# EAGLE design TIVA_SHIELD_Ver_2.0 (EAGLE 9.6.2)
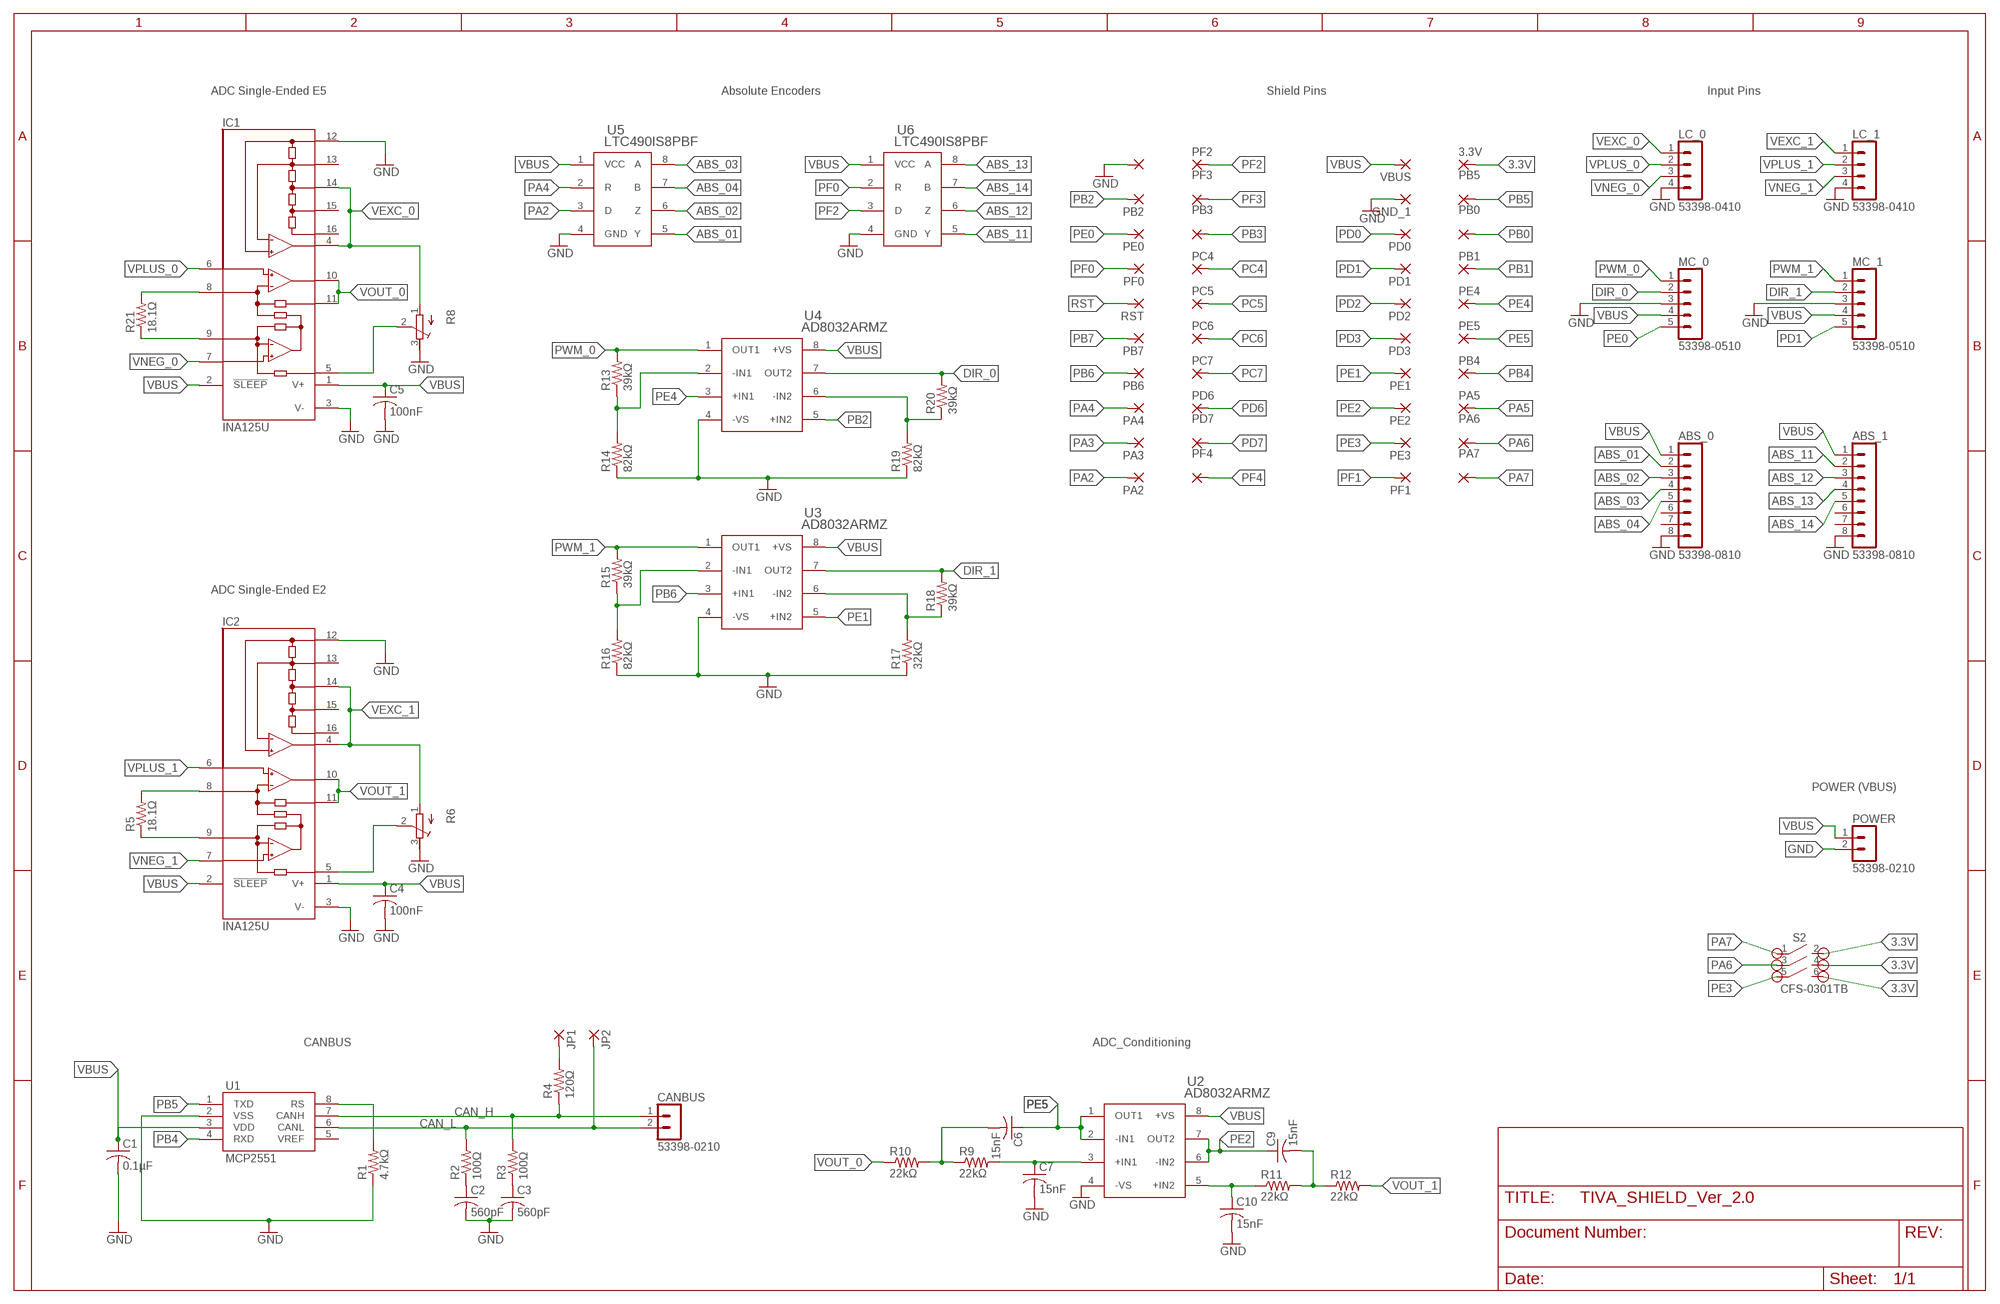
[diagram p0: schematic, sheet 1]

## Parts
3.3V  1,6/0,9  [1,6/0,9]
ABS_0  53398-0810  [53398-0810]
ABS_1  53398-0810  [53398-0810]
C1  0.1µF  C-USC0805  [C0805]
C2  560pF  C-USC0805  [C0805]
C3  560pF  C-USC0805  [C0805]
C4  100nF  C-USC0805  [C0805]
C5  100nF  C-USC0805  [C0805]
C6  15nF  C-USC0805  [C0805]
C7  15nF  C-USC0805  [C0805]
C9  15nF  C-USC0805  [C0805]
C10  15nF  C-USC0805  [C0805]
CANBUS  53398-0210  [53398-0210]
GND_0  1,6/0,9  [1,6/0,9]
GND_1  1,6/0,9  [1,6/0,9]
IC1  INA125U  [SO16-1]
IC2  INA125U  [SO16-1]
JP1  1,6/0,9  [1,6/0,9]
JP2  1,6/0,9  [1,6/0,9]
LC_0  53398-0410  [53398-0410]
LC_1  53398-0410  [53398-0410]
MC_0  53398-0510  [53398-0510]
MC_1  53398-0510  [53398-0510]
PA2  1,6/0,9  [1,6/0,9]
PA3  1,6/0,9  [1,6/0,9]
PA4  1,6/0,9  [1,6/0,9]
PA5  1,6/0,9  [1,6/0,9]
PA6  1,6/0,9  [1,6/0,9]
PA7  1,6/0,9  [1,6/0,9]
PB0  1,6/0,9  [1,6/0,9]
PB1  1,6/0,9  [1,6/0,9]
PB2  1,6/0,9  [1,6/0,9]
PB3  1,6/0,9  [1,6/0,9]
PB4  1,6/0,9  [1,6/0,9]
PB5  1,6/0,9  [1,6/0,9]
PB6  1,6/0,9  [1,6/0,9]
PB7  1,6/0,9  [1,6/0,9]
PC4  1,6/0,9  [1,6/0,9]
PC5  1,6/0,9  [1,6/0,9]
PC6  1,6/0,9  [1,6/0,9]
PC7  1,6/0,9  [1,6/0,9]
PD0  1,6/0,9  [1,6/0,9]
PD1  1,6/0,9  [1,6/0,9]
PD2  1,6/0,9  [1,6/0,9]
PD3  1,6/0,9  [1,6/0,9]
PD6  1,6/0,9  [1,6/0,9]
PD7  1,6/0,9  [1,6/0,9]
PE0  1,6/0,9  [1,6/0,9]
PE1  1,6/0,9  [1,6/0,9]
PE2  1,6/0,9  [1,6/0,9]
PE3  1,6/0,9  [1,6/0,9]
PE4  1,6/0,9  [1,6/0,9]
PE5  1,6/0,9  [1,6/0,9]
PF0  1,6/0,9  [1,6/0,9]
PF1  1,6/0,9  [1,6/0,9]
PF2  1,6/0,9  [1,6/0,9]
PF3  1,6/0,9  [1,6/0,9]
PF4  1,6/0,9  [1,6/0,9]
POWER  53398-0210  [53398-0210]
R1  4.7kΩ  R-US_R0805  [R0805]
R2  100Ω  R-US_R0805  [R0805]
R3  100Ω  R-US_R0805  [R0805]
R4  120Ω  R-US_R0805  [R0805]
R5  18.1Ω  R-US_R0805  [R0805]
R6  R-TRIMM64W  [RTRIM64W]
R8  R-TRIMM64W  [RTRIM64W]
R9  22kΩ  R-US_R0805  [R0805]
R10  22kΩ  R-US_R0805  [R0805]
R11  22kΩ  R-US_R0805  [R0805]
R12  22kΩ  R-US_R0805  [R0805]
R13  39kΩ  R-US_R0805  [R0805]
R14  82kΩ  R-US_R0805  [R0805]
R15  39kΩ  R-US_R0805  [R0805]
R16  82kΩ  R-US_R0805  [R0805]
R17  32kΩ  R-US_R0805  [R0805]
R18  39kΩ  R-US_R0805  [R0805]
R19  82kΩ  R-US_R0805  [R0805]
R20  39kΩ  R-US_R0805  [R0805]
R21  18.1Ω  R-US_R0805  [R0805]
RST  1,6/0,9  [1,6/0,9]
S2  CFS-0301TB  CFS-0301TBSMD  [CFS-0301TB]
U1  MCP2551  [SO08]
U2  AD8032ARMZ  [RM_8]
U3  AD8032ARMZ  [RM_8]
U4  AD8032ARMZ  [RM_8]
U5  LTC490IS8PBF  [SO-8_S]
U6  LTC490IS8PBF  [SO-8_S]
VBUS  1,6/0,9  [1,6/0,9]

## Nets
3.3V: 3.3V.1(P) S2.2 S2.4 S2.6
ABS_01: ABS_0.2 U5.5(Y)
ABS_02: ABS_0.3 U5.6(Z)
ABS_03: ABS_0.4 U5.8(A)
ABS_04: ABS_0.5 U5.7(B)
ABS_11: ABS_1.2 U6.5(Y)
ABS_12: ABS_1.3 U6.6(Z)
ABS_13: ABS_1.4 U6.8(A)
ABS_14: ABS_1.5 U6.7(B)
CAN_H: CANBUS.1 R3.2 R4.1 U1.7(CANH)
CAN_L: CANBUS.2 JP2.1(P) R2.2 U1.6(CANL)
DIR_0: MC_0.2 R20.2 U4.7(OUT2)
DIR_1: MC_1.2 R18.2 U3.7(OUT2)
GND: ABS_0.8 ABS_1.8 C1.2 C2.2 C3.2 C4.2 C5.2 C7.2 C10.2 GND_0.1(P) GND_1.1(P) IC1.3(V-) IC1.12(REFCOM) IC2.3(V-) IC2.12(REFCOM) LC_0.4 LC_1.4 MC_0.3 MC_1.3 POWER.2 R1.1 R6.3(E) R8.3(E) R14.1 R16.1 R17.1 R19.1 U1.2(VSS) U2.4(-VS) U3.4(-VS) U4.4(-VS) U5.4(GND) U6.4(GND)
N$1: R1.2 U1.8(RS)
N$4: C2.1 R2.1
N$5: C3.1 R3.1
N$6: JP1.1(P) R4.2
N$7: IC2.9(RG) R5.1
N$8: IC2.8(RG) R5.2
N$9: IC2.5(REF) R6.2(S)
N$10: IC1.9(RG) R21.1
N$11: IC1.8(RG) R21.2
N$12: IC1.5(REF) R8.2(S)
N$13: C10.1 R11.1 U2.5(+IN2)
N$14: C9.2 R11.2 R12.1
N$15: C7.1 R9.2 U2.3(+IN1)
N$16: R19.2 R20.1 U4.6(-IN2)
N$17: R17.2 R18.1 U3.6(-IN2)
N$18: C6.2 R9.1 R10.2
N$19: R13.1 R14.2 U4.2(-IN1)
N$20: R15.1 R16.2 U3.2(-IN1)
PA2: PA2.1(P) U5.3(D)
PA3: PA3.1(P)
PA4: PA4.1(P) U5.2(R)
PA5: PA5.1(P)
PA6: PA6.1(P) S2.3
PA7: PA7.1(P) S2.1
PB0: PB0.1(P)
PB1: PB1.1(P)
PB2: PB2.1(P) U4.5(+IN2)
PB3: PB3.1(P)
PB4: PB4.1(P) U1.4(RXD)
PB5: PB5.1(P) U1.1(TXD)
PB6: PB6.1(P) U3.3(+IN1)
PB7: PB7.1(P)
PC4: PC4.1(P)
PC5: PC5.1(P)
PC6: PC6.1(P)
PC7: PC7.1(P)
PD0: PD0.1(P)
PD1: MC_1.5 PD1.1(P)
PD2: PD2.1(P)
PD3: PD3.1(P)
PD6: PD6.1(P)
PD7: PD7.1(P)
PE0: MC_0.5 PE0.1(P)
PE1: PE1.1(P) U3.5(+IN2)
PE2: C9.1 PE2.1(P) U2.6(-IN2) U2.7(OUT2)
PE3: PE3.1(P) S2.5
PE4: PE4.1(P) U4.3(+IN1)
PE5: C6.1 PE5.1(P) U2.1(OUT1) U2.2(-IN1)
PF0: PF0.1(P) U6.2(R)
PF1: PF1.1(P)
PF2: PF2.1(P) U6.3(D)
PF3: PF3.1(P)
PF4: PF4.1(P)
PWM_0: MC_0.1 R13.2 U4.1(OUT1)
PWM_1: MC_1.1 R15.2 U3.1(OUT1)
RST: RST.1(P)
VBUS: ABS_0.1 ABS_1.1 C1.1 C4.1 C5.1 IC1.1(V+) IC1.2(!SLEEP) IC2.1(V+) IC2.2(!SLEEP) MC_0.4 MC_1.4 POWER.1 U1.3(VDD) U2.8(+VS) U3.8(+VS) U4.8(+VS) U5.1(VCC) U6.1(VCC) VBUS.1(P)
VEXC_0: IC1.4(REFOUT) IC1.14(REF2.5) LC_0.1 R8.1(A)
VEXC_1: IC2.4(REFOUT) IC2.14(REF2.5) LC_1.1 R6.1(A)
VNEG_0: IC1.7(-IN) LC_0.3
VNEG_1: IC2.7(-IN) LC_1.3
VOUT_0: IC1.10(OUT) IC1.11(SENSE) R10.1
VOUT_1: IC2.10(OUT) IC2.11(SENSE) R12.2
VPLUS_0: IC1.6(+IN) LC_0.2
VPLUS_1: IC2.6(+IN) LC_1.2
Unconnected: ABS_0.6 ABS_0.7 ABS_1.6 ABS_1.7 IC1.13(REFBG) IC1.15(REF5) IC1.16(REF10) IC2.13(REFBG) IC2.15(REF5) IC2.16(REF10) U1.5(VREF)

## Notes on the sheet
- ADC Single-Ended E5 | Absolute Encoders | Shield Pins | Input Pins
- ADC Single-Ended E2
- POWER (VBUS)
- CANBUS | ADC_Conditioning

## Library data of the parts
3.3V GND_0 GND_1 JP1 JP2 PA2-PA7 PB0 PB1-PB7 PC4-PC7 PD0 PD1-PD3 PD6 PD7 PE0 PE1-PE5 PF0 PF1-PF4 RST VBUS = wirepad:1,6/0,9: THROUGH-HOLE PAD
ABS_0 ABS_1 = con-molex-picoblade:53398-0810: HEADER
C1-C7 C9 C10 = rcl:C-US: CAPACITOR, American symbol; SPICEPREFIX: C
CANBUS POWER = con-molex-picoblade:53398-0210: HEADER
IC1 IC2 = burr-brown_1:INA125: Instrumentation Amplifier with Precision Voltage Reference; MF: TEXAS INSTRUMENT CONNECTORS; MPN: INA125U; OC_FARNELL: 1304375; OC_NEWARK: 80K5901
LC_0 LC_1 = con-molex-picoblade:53398-0410: HEADER
MC_0 MC_1 = con-molex-picoblade:53398-0510: HEADER
R1-R5 R9-R21 = rcl:R-US_: RESISTOR, American symbol; SPICEPREFIX: R
R6 R8 = rcl:R-TRIMM: Trimm resistor; SPICEMODEL: X; SPICEPREFIXL: POT
S2 = TREC_Library:CFS-0301TB: CFS Slide Switches 3 Position Slide Switch CFS-0301TB CFS = Series Name 03 = Number of bits 01 = Flat Knob non washable type T = Packing = Taping B = Gull Wing CFS DATASHEET <https://www.nidec-copal-electronics.com/e/catalog/switch/cfs.pdf>
U1 = SparkFun-IC-Comms:MCP2551: MCP2551 High Speed CAN Transceiver High speed CAN transceiver Datasheet <http://www.sparkfun.com/datasheets/DevTools/Arduino/MCP2551.pdf> SparkFun Products CAN-BUS Shield <https://www.sparkfun.com/products/13262> (DEV-13262) SparkFun OBD-II UART <https://www.sparkfun.com/products/9555> (WIG-09555); PROD_ID: IC-09907
U2-U4 = AD8032ARMZ:AD8032ARMZ; MANUFACTURER_PART_NUMBER: AD8032ARMZ; VENDOR: Analog Devices Inc
U5 U6 = LTC490:LTC490IS8PBF; MANUFACTURER_PART_NUMBER: LTC490IS8#PBF; VENDOR: Linear Technology

## Board
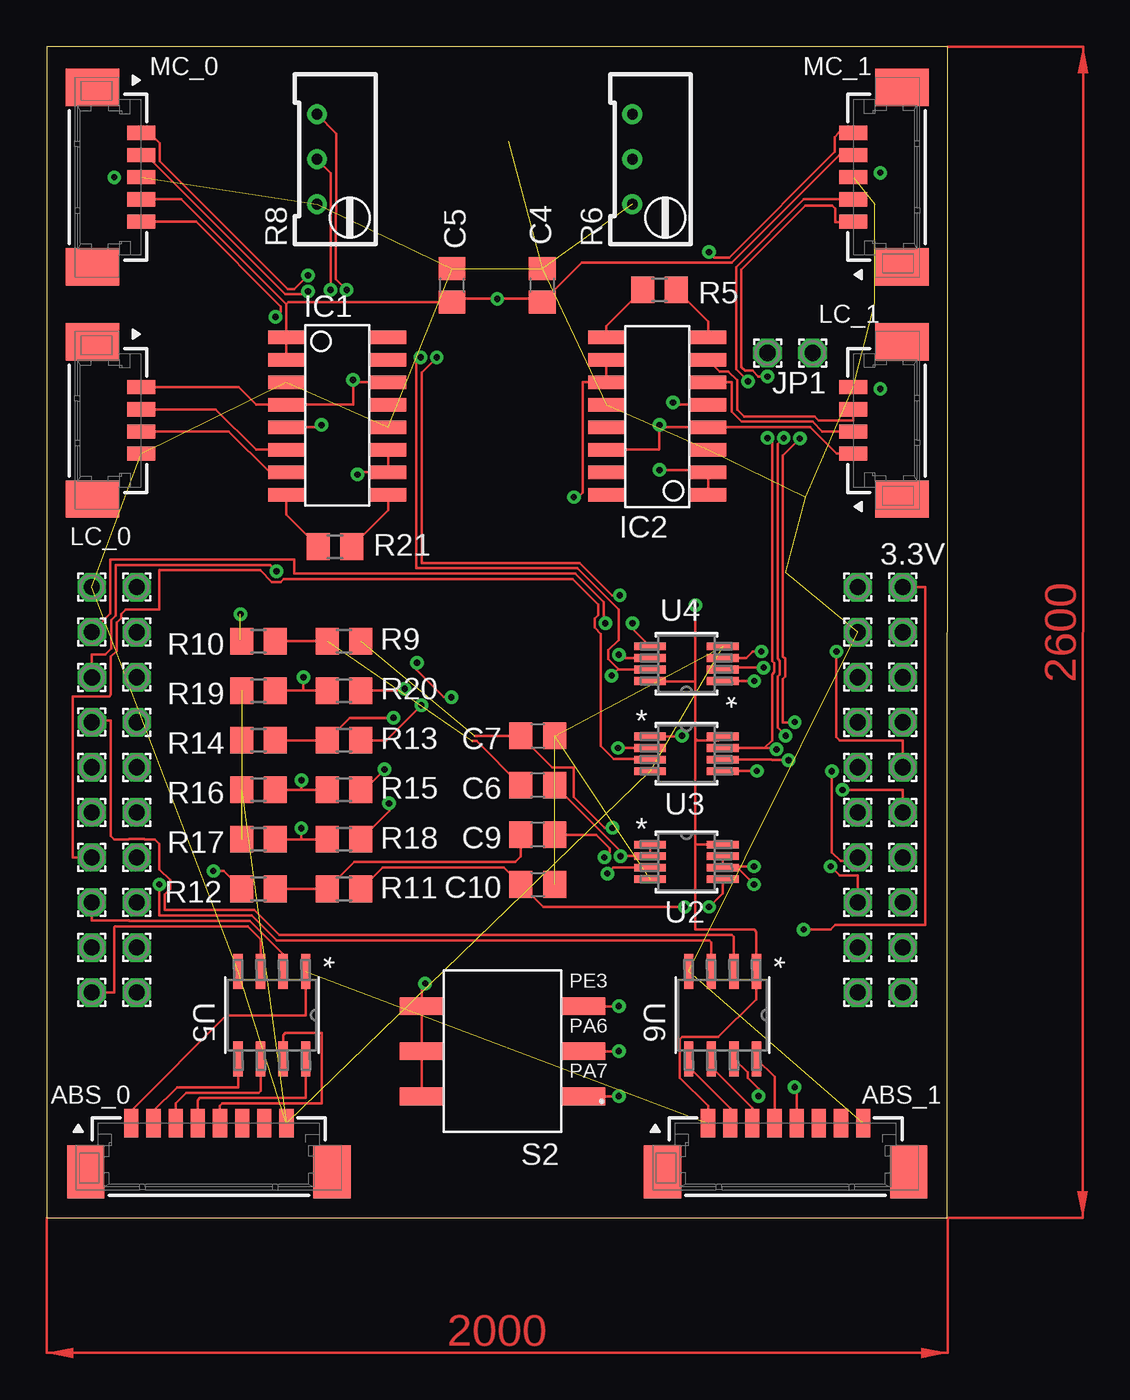
[diagram p1: board, top side]
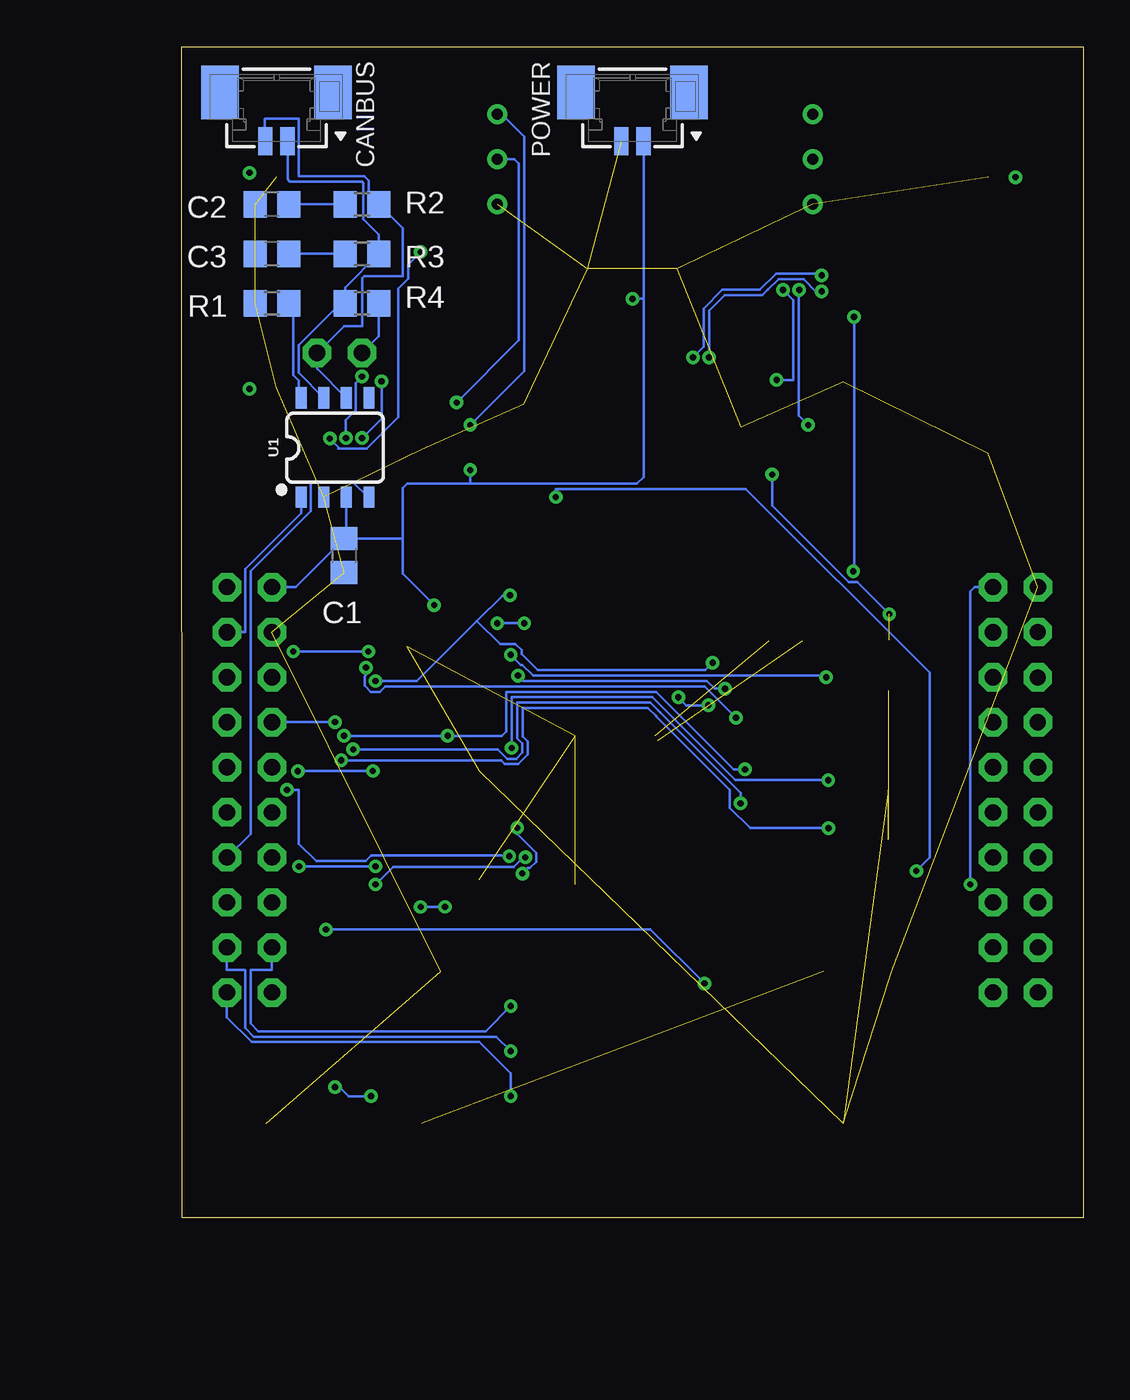
[diagram p2: board, bottom side, seen from below]

Size 50.81 x 66.04 mm. Coordinates in mm from the lower left corner, seen from the top.
Outline: 0,0 50.78,0 50.8,66.04 0,66.04 0,0
Copper layers (1*16): Top 0.035mm / dielectric 1.5mm / Bottom 0.035mm
Design rules "default": minimum track width 6mil, minimum drill 0.35mm, track to track 6mil, track to pad 6mil, pad to pad 6mil, via to via 6mil, smd to smd 6mil, copper to edge 40mil, drill to drill 6mil, minimum pad ring 10mil, minimum via ring 8mil, stop-mask expansion 4mil, vias tented up to drill 0mil, thermal gap 10mil

### Footprints (pad centres in the part's own frame; a part is rotated, then mirrored left to right if it is on the bottom)
1,6/0,9 = drill 0.914 pad 1.6 octagon: 1 0,0
53398-0810 = smd 0.8 x 1.6: 1 4.375,0; 2 3.125,0; 3 1.875,0; 4 0.625,0; 5 -0.625,0; 6 -1.875,0; 7 -3.125,0; 8 -4.375,0 | smd 2.1 x 3: M1 6.935,2.75; M2 -6.935,2.75
C0805 = smd 1.3 x 1.5: 1 -0.95,0; 2 0.95,0
53398-0210 = smd 0.8 x 1.6: 1 0.625,0; 2 -0.625,0 | smd 2.1 x 3: M1 3.185,2.75; M2 -3.185,2.75
SO16-1 = smd 0.762 x 2.032: 1 -4.445,-4.775; 2 -3.175,-4.775; 3 -1.905,-4.775; 4 -0.635,-4.775; 5 0.635,-4.775; 6 1.905,-4.775; 7 3.175,-4.775; 8 4.445,-4.775; 9 4.445,0.965; 10 3.175,0.965; 11 1.905,0.965; 12 0.635,0.965; 13 -0.635,0.965; 14 -1.905,0.965; 15 -3.175,0.965; 16 -4.445,0.965
53398-0410 = smd 0.8 x 1.6: 1 1.875,0; 2 0.625,0; 3 -0.625,0; 4 -1.875,0 | smd 2.1 x 3: M1 4.435,2.75; M2 -4.435,2.75
53398-0510 = smd 0.8 x 1.6: 1 2.5,0; 2 1.25,0; 3 0,0; 4 -1.25,0; 5 -2.5,0 | smd 2.1 x 3: M1 5.06,2.75; M2 -5.06,2.75
R0805 = smd 1.3 x 1.5: 1 -0.95,0; 2 0.95,0
RTRIM64W = drill 0.61: 1 1.27,-2.54; 2 1.27,0; 3 1.27,2.54
CFS-0301TB = smd 1 x 2.5: 1 0.5,1.25; 2 0.5,10.35; 3 3.04,1.25; 4 3.04,10.35; 5 5.58,1.25; 6 5.58,10.35
SO08 = smd 0.6 x 1.2: 1 -1.905,-2.8; 2 -0.635,-2.8; 3 0.635,-2.8; 4 1.905,-2.8; 5 1.905,2.8; 6 0.635,2.8; 7 -0.635,2.8; 8 -1.905,2.8
RM_8 = smd 1.778 x 0.432: 1 -2.045,0.975; 2 -2.045,0.325; 3 -2.045,-0.325; 4 -2.045,-0.975; 5 2.045,-0.975; 6 2.045,-0.325; 7 2.045,0.325; 8 2.045,0.975
SO-8_S = smd 1.981 x 0.533: 1 -2.464,1.905; 2 -2.464,0.635; 3 -2.464,-0.635; 4 -2.464,-1.905; 5 2.464,-1.905; 6 2.464,-0.635; 7 2.464,0.635; 8 2.464,1.905

### Placement (x,y rotation side)
3.3V  48.26,35.56 0 top
ABS_0  9.14,5.33 180 top
ABS_1  41.66,5.33 180 top
C1  41.66,37.34 270 bottom
C2  45.72,57.15 180 bottom
C3  45.72,54.36 180 bottom
C4  27.94,52.58 90 top
C5  22.86,52.58 90 top
C6  27.69,24.38 180 top
C7  27.69,27.18 0 top
C9  27.69,21.59 180 top
C10  27.69,18.8 0 top
CANBUS  45.47,60.71 0 bottom
GND_0  2.54,35.56 0 top
GND_1  45.72,33.02 0 top
IC1  18.29,45.21 270 top
IC2  32.51,45.21 90 top
JP1  40.64,48.77 90 top
JP2  43.18,48.77 90 top
LC_0  5.33,44.96 90 top
LC_1  45.47,44.96 270 top
MC_0  5.33,58.67 90 top
MC_1  45.47,58.67 270 top
PA2  2.54,12.7 0 top
PA3  2.54,15.24 0 top
PA4  2.54,17.78 0 top
PA5  48.26,17.78 0 top
PA6  48.26,15.24 0 top
PA7  48.26,12.7 0 top
PB0  48.26,30.48 0 top
PB1  48.26,27.94 0 top
PB2  2.55,33.03 0 top
PB3  5.08,30.48 0 top
PB4  48.26,20.32 0 top
PB5  48.26,33.02 0 top
PB6  2.54,20.32 0 top
PB7  2.54,22.86 0 top
PC4  5.08,27.94 0 top
PC5  5.08,25.4 0 top
PC6  5.08,22.86 0 top
PC7  5.08,20.32 0 top
PD0  45.72,30.48 0 top
PD1  45.72,27.94 0 top
PD2  45.72,25.4 0 top
PD3  45.72,22.86 0 top
PD6  5.08,17.78 0 top
PD7  5.08,15.24 0 top
PE0  2.55,30.47 0 top
PE1  45.72,20.32 0 top
PE2  45.72,17.78 0 top
PE3  45.72,15.24 0 top
PE4  48.26,25.4 0 top
PE5  48.26,22.86 0 top
PF0  2.55,27.95 0 top
PF1  45.72,12.7 0 top
PF2  5.08,35.56 0 top
PF3  5.08,33.02 0 top
PF4  5.08,12.7 0 top
POWER  25.4,60.71 0 bottom
R1  45.72,51.56 0 bottom
R2  40.64,57.15 0 bottom
R3  40.64,54.36 0 bottom
R4  40.64,51.56 0 bottom
R5  34.54,52.32 0 top
R6  34.29,59.69 180 top
R8  16.51,59.69 180 top
R9  16.76,32.51 0 top
R10  11.94,32.51 0 top
R11  16.76,18.54 180 top
R12  11.94,18.54 180 top
R13  16.76,26.92 0 top
R14  11.94,26.92 0 top
R15  16.76,24.13 0 top
R16  11.94,24.13 0 top
R17  11.94,21.34 0 top
R18  16.76,21.34 0 top
R19  11.94,29.72 0 top
R20  16.76,29.72 0 top
R21  16.26,37.85 180 top
RST  2.54,25.4 0 top
S2  31.5,6.35 90 top
U1  42.16,43.43 0 bottom
U2  36.07,20.07 0 top
U3  36.07,26.16 0 top
U4  36.07,31.24 180 top
U5  12.7,11.43 270 top
U6  38.1,11.43 270 top
VBUS  45.72,35.56 0 top

### Tracks (layer width: path | path; a pad name or v marks a point on that pad's centre or on a via)
3.3V  (via drill 0.35)
  Top 0.152: S2.2 S2.4 S2.6 21.15,13.02 v21.34,13.21 | v42.67,16.26 44.2,16.26 44.45,16.51 49.53,16.51 49.53,35.56 3.3V.1
  Bottom 0.152: v21.34,13.21 24.38,16.26 v42.67,16.26
ABS_01
  Top 0.152: ABS_0.2 6.02,6.02 7.36,7.36 10.8,7.36 U5.5
ABS_02
  Top 0.152: ABS_0.3 7.27,6.45 7.87,7.05 11.96,7.05 12.06,7.16 U5.6
ABS_03
  Top 0.152: ABS_0.4 8.52,6.63 8.64,6.75 14.59,6.75 14.61,6.76 U5.8
ABS_04
  Top 0.152: ABS_0.5 9.77,6.31 9.91,6.44 15.52,6.44 15.52,10.39 15.49,10.41 13.46,10.41 13.34,10.29 U5.7
ABS_11
  Top 0.152: ABS_1.2 38.53,6.17 36.2,8.51 U6.5
ABS_12
  Top 0.152: ABS_1.3 39.78,6.19 37.47,8.51 U6.6
ABS_13
  Top 0.152: ABS_1.4 41.03,7.94 U6.8
ABS_14  (via drill 0.35)
  Top 0.152: U6.7 39.51,8.19 39.51,7.88 40.13,7.26 v40.13,6.86 | v42.16,7.37 42.28,7.25 ABS_1.5
  Bottom 0.152: v40.13,6.86 41.4,6.86 41.91,7.37 v42.16,7.37
CAN_H
  Bottom 0.152: CANBUS.1 44.84,58.56 44.7,58.42 40.64,58.42 40.57,58.35 40.57,56.3 39.69,55.43 R3.2 41.59,52.46 R4.1 41.84,51.56 44.21,49.19 44.21,47.64 U1.7
CAN_L
  Bottom 0.152: CANBUS.2 46.12,60.73 46.12,61.96 46.1,61.98 44.2,61.98 44.2,58.73 40.51,58.73 40.26,58.48 40.26,57.72 R2.2 38.35,55.81 38.35,53.09 40.53,53.09 40.64,52.98 40.64,50.29 41.66,50.29 JP2.1 43.18,47.88 U1.6
DIR_0  (via drill 0.35)
  Top 0.152: 5.35,59.94 MC_0.2 5.61,59.92 13.46,52.07 14.57,52.07 v14.73,52.23 | U4.7 32.24,30.92 32.23,30.92 32.21,30.94 | v21.08,48.51 20.83,48.26 20.83,36.63 29.92,36.63 32.24,34.31 32.24,32.59 31.65,32 31.65,31.5 32.21,30.94 | R20.2 20.07,29.72 v20.18,29.84 | v31.85,30.57 32.21,30.93 32.21,30.94
  Bottom 0.152: v21.08,48.51 21.08,51.15 20.21,52.02 18.09,52.02 17.78,52.32 17.77,52.32 17.16,52.93 15.75,52.93 15.05,52.23 v14.73,52.23 | v20.18,29.84 20.77,29.84 21.2,30.27 31.55,30.27 v31.85,30.57
DIR_1  (via drill 0.35)
  Top 0.152: U3.7 40.46,26.49 | 40.46,26.49 40.89,26.92 40.89,30.64 41.03,30.77 41.03,31.27 40.89,31.41 40.89,43.72 v40.64,43.97 | v39.54,47.17 38.86,47.84 38.86,53.59 42.69,57.42 MC_1.2 | R18.2 19.3,22.93 v19.3,23.37 | v41.14,26.41 41.06,26.49 40.46,26.49
  Bottom 0.152: v40.64,43.97 39.54,45.07 v39.54,47.17 | v19.3,23.37 19.3,23.95 23.84,28.49 23.94,28.59 24.4,29.05 31.9,29.05 31.89,29.03 31.89,27.02 31.6,26.74 31.6,26.24 31.96,25.88 32.46,25.88 32.99,26.41 v41.14,26.41
GND  (32 unrouted)
N$1
  Bottom 0.152: U1.8 44.2,46.36 44.2,47.2 44.51,47.52 44.51,51.31 R1.2
N$2  (via drill 0.35)
  other vias: 46.99,58.93
N$3  (via drill 0.35)
  other vias: 3.81,58.67
N$4
  Bottom 0.152: C2.1 R2.1
N$5
  Bottom 0.152: R3.1 C3.1
N$6
  Bottom 0.152: JP1.1 39.69,49.72 R4.2
N$7
  Top 0.152: R5.1 31.55,50.28 IC2.9
N$8
  Top 0.152: R5.2 37.29,50.53 IC2.8
N$9  (via drill 0.35)
  Top 0.152: IC2.5 35.43,45.85 v35.31,45.97
  Bottom 0.152: v35.31,45.97 31.8,49.48 31.8,59.44 32.05,59.69 R6.2
N$10
  Top 0.152: R21.1 19.25,39.89 IC1.9
N$11
  Top 0.152: R21.2 13.51,39.64 IC1.8
N$12  (via drill 0.35)
  Top 0.152: IC1.5 15.37,44.58 v15.49,44.7 | v16,52.32 16,56.8 16.03,56.82 16.03,58.9 R8.2
  Bottom 0.152: v15.49,44.7 16.03,45.24 16.03,52.3 v16,52.32
N$13  (via drill 0.35)
  Top 0.152: R11.1 18.93,19.76 25.77,19.76 C10.1 28.01,17.53 v35.97,17.53 | v37.34,17.53 38.11,18.3 U2.5
  Bottom 0.152: v35.97,17.53 v37.34,17.53
N$14
  Top 0.152: R12.1 R11.2 17.34,20.07 26.42,20.07 26.74,20.39 C9.2
N$15  (via drill 0.35)  (1 unrouted)
  Top 0.152: 24.13,27.18 C7.1 28.51,25.4 29.72,25.4 29.72,23.73 31.46,21.99 v31.89,21.99 | v31.61,19.41 31.94,19.74 U2.3
  Bottom 0.152: v31.89,21.99 31.89,21.64 30.83,20.57 30.83,20.07 31.18,19.71 31.3,19.71 v31.61,19.41
N$16  (via drill 0.35)
  Top 0.152: U4.6 32.44,31.57 v32.26,31.75 | R20.1 14.48,29.72 | 14.48,29.72 R19.2 | v14.48,30.48 14.48,29.72
  Bottom 0.152: v32.26,31.75 31.68,31.18 31.6,31.18 30.99,30.57 14.57,30.57 v14.48,30.48
N$17  (via drill 0.35)
  Top 0.152: R18.1 14.34,21.34 | 14.34,21.34 R17.2 | U3.6 40.85,25.84 40.89,25.8 v41.81,25.8 v41.82,25.8 | v14.35,21.97 14.35,21.35 14.34,21.34
  Bottom 0.152: v41.82,25.8 32.81,25.8 32.59,25.58 31.83,25.58 31.3,26.11 31.3,26.87 31.58,27.15 31.58,28.74 26.16,28.74 25.91,28.74 24.53,28.74 24.07,28.29 24.05,28.27 19.91,24.13 19.91,23.12 18.76,21.97 v14.35,21.97
N$18  (1 unrouted)
  Top 0.152: R9.1 R10.2 | C6.2 24.25,26.87 24,26.87
N$19  (via drill 0.35)
  Top 0.152: U4.2 38.22,31.02 v40.42,31.02 | R14.2 R13.1 17.08,28.19 v19.56,28.19
  Bottom 0.152: v40.42,31.02 40.42,30.59 40.49,30.52 40.49,30.02 40.14,29.66 39.64,29.66 39.34,29.96 21.33,29.96 v19.56,28.19
N$20  (via drill 0.35)
  Top 0.152: U3.2 32.72,26.49 v32.21,26.49 | R15.1 14.36,24.13 | 14.36,24.13 R16.2 | v14.36,24.68 14.36,24.14 14.36,24.13
  Bottom 0.152: v14.36,24.68 19.6,24.68 24.27,29.35 32.21,29.35 32.21,28.64 v32.21,26.49
N$21  (via drill 0.35)
  other vias: 46.99,46.74
PA2
  Top 0.152: U5.3 12.06,15.7 11.34,16.43 3.87,16.43 3.81,16.37 3.81,12.7 PA2.1
PA4
  Top 0.152: U5.2 13.34,14.86 11.44,16.75 4.65,16.75 4.64,16.76 2.54,16.76 PA4.1
PA6  (via drill 0.35)
  Top 0.152: S2.3 v32.25,9.39 v32.26,9.4
  Bottom 0.152: PA6.1 48.26,13.97 47.24,13.97 47.23,13.96 47.23,10.71 46.74,10.21 33.07,10.21 v32.26,9.4
PA7  (via drill 0.35)
  Top 0.152: S2.1 v32.25,6.85 v32.26,6.86
  Bottom 0.152: PA7.1 48.26,11.3 46.86,9.91 34.04,9.91 32.26,8.13 v32.26,6.86
PB2  (via drill 0.35)
  Top 0.152: U4.5 33.02,33.22 v33.02,33.53 | PB2.1 3.59,34.07 3.59,37.12 13.97,37.12 13.97,36.32 29.8,36.32 31.41,34.71 31.41,33.62 v31.5,33.53
  Bottom 0.152: v33.02,33.53 v31.5,33.53
PB4
  Bottom 0.152: U1.4 40.31,40.63 41.13,41.46 43.43,41.46 | 43.43,41.46 43.52,41.46 43.54,41.45 | 43.43,41.46 43.54,41.36 43.54,39.85 46.92,36.46 46.92,21.66 PB4.1
PB5
  Bottom 0.152: U1.1 44.07,39.75 47.23,36.59 47.23,34.58 47.23,33.03 47.24,33.02 PB5.1
PB6
  Top 0.152: U3.3 33.98,25.88 31.96,25.88 31.24,26.6 31.24,32.92 30.89,33.28 30.89,33.78 31.1,33.99 31.1,34.58 29.67,36.02 13.37,36.02 13.21,35.85 12.7,35.85 12.04,36.51 6.35,36.51 6.35,34.29 4.46,34.29 4.2,34.04 4.2,33.82 3.95,33.57 3.95,31.97 3.62,31.64 3.62,29.49 3.52,29.39 1.46,29.39 1.46,20.32 PB6.1
PD1  (via drill 0.35)
  Top 0.152: MC_1.5 44.66,61.17 44.43,60.94 44.43,60.1 38.48,54.15 37.64,54.15 v37.34,54.45 | v42.46,43.94 41.5,42.99 41.5,31.66 41.64,31.52 41.64,30.52 41.5,30.39 41.5,27.94 v42.16,27.94 v42.17,27.95
  Bottom 0.152: v37.34,54.45 38.05,53.74 38.05,52.96 38.61,52.4 38.61,45.14 40.39,43.36 41.91,43.36 | 41.91,43.36 41.98,43.36 | 41.91,43.36 42.46,43.91 v42.46,43.94 | v42.17,27.95 PD1.1
PE0  (via drill 0.35)
  Top 0.152: MC_0.5 8.42,56.17 13.21,51.38 13.21,51.1 v12.91,50.8 | v12.95,36.46 12.6,36.82 3.9,36.82 3.9,33.95 3.64,33.69 3.64,32.09 3.3,31.75 2.54,31.75 2.54,30.48 PE0.1
  Bottom 0.152: v12.91,50.8 12.91,36.51 v12.95,36.46
PE1  (via drill 0.35)
  Top 0.152: U3.5 v40.03,25.19 | v44.26,25.18 44.26,20.61 44.75,20.11 45.51,20.11 PE1.1
  Bottom 0.152: v40.03,25.19 44.25,25.19 v44.26,25.18
PE2  (via drill 0.35)
  Top 0.152: U2.7 U2.6 38.18,19.81 38.86,19.81 | 38.86,19.81 v39.88,19.81 | v44.2,19.81 44.72,19.29 45.72,19.29 PE2.1 | C9.1 30.99,21.59 31.75,20.83 31.75,20.66 31.74,20.64 31.74,20.62 v31.43,20.32 | v39.88,18.8 38.86,19.81
  Bottom 0.152: v39.88,19.81 v44.2,19.81 | v31.43,20.32 31.56,20.32 32.09,19.78 38.89,19.78 v39.88,18.8
PE3  (via drill 0.35)
  Top 0.152: S2.5 v32.25,11.93 v32.26,11.94
  Bottom 0.152: v32.26,11.94 33.68,10.52 46.48,10.52 46.93,10.96 46.93,13.97 45.72,13.97 PE3.1
PE4  (via drill 0.35)
  Top 0.152: U4.3 39.44,31.57 39.8,31.93 v40.29,31.93 | v44.52,31.93 44.52,27.11 44.72,26.91 48.26,26.91 PE4.1
  Bottom 0.152: v40.29,31.93 v44.52,31.93
PE5  (via drill 0.35)
  Top 0.152: U2.1 U2.2 v32.34,20.39 | v44.87,24.13 48.26,24.13 PE5.1 | v32.34,20.39 | C6.1 32.34,20.68 v32.34,20.39
  Bottom 0.152: v44.87,24.13 44.2,24.13 44.2,21.08 43.23,20.12 40.43,20.12 40.13,20.42 32.37,20.42 v32.34,20.39
PF0
  Top 0.152: U6.2 38.73,15.82 38.61,15.95 13.11,15.95 11.7,17.36 6.66,17.36 6.66,18.24 6.96,18.55 6.96,19.05 6.35,19.65 6.35,21.08 6.1,21.34 5.52,21.34 5.51,21.35 4.65,21.35 4.64,21.34 3.81,21.34 3.62,21.53 3.62,28.05 2.65,28.05 PF0.1
PF2  (via drill 0.35)
  Top 0.152: U6.3 37.47,15.52 37.34,15.65 12.98,15.65 11.57,17.06 6.35,17.06 v6.35,18.8
  Bottom 0.152: v6.35,18.8 6.35,35.31 6.1,35.56 PF2.1
PWM_0  (via drill 0.35)
  Top 0.152: 5.36,61.15 MC_0.1 5.8,61.17 6.37,60.6 6.37,59.59 13.59,52.38 13.97,52.38 v14.73,53.14 | U4.1 v39.89,30.27 | 31.9,35.1 v32.31,35.1 31.88,35.1 30.05,36.93 21.13,36.93 21.13,47.66 v21.99,48.51 | R13.2 19.15,26.92 v21.12,28.9 | v22.81,29.36 22.38,29.36 20.83,30.91 20.83,31.24 v20.88,31.29
  Bottom 0.152: v39.89,30.27 37.55,30.27 34.16,33.66 | v32.31,35.1 32.72,35.1 34.16,33.66 | v21.99,48.51 21.39,49.12 21.39,51.27 20.34,52.32 18.21,52.32 17.3,53.24 14.82,53.24 v14.73,53.14 | v21.12,28.9 22.35,28.9 v22.81,29.36 | v20.88,31.29 21.29,30.88 30.73,30.88 31.65,31.79 31.65,32 32.01,32.36 32.87,32.36 34.16,33.66
PWM_1  (via drill 0.35)
  Top 0.152: U3.1 35.77,27.14 v35.81,27.18 | v41.66,27.18 41.2,27.64 41.2,30.51 41.33,30.64 41.33,31.4 41.2,31.53 41.2,43.62 v41.55,43.97 | v40.64,47.44 40.13,47.44 39.79,47.77 39.37,47.77 39.17,47.98 39.17,53.47 42.76,57.06 44.28,57.06 44.45,56.9 44.45,56.13 45.43,56.13 MC_1.1 | v19.05,25.28 17.9,24.13 R15.2
  Bottom 0.152: v41.66,27.18 v35.81,27.18 32.77,27.18 32.51,27.43 32.51,28.77 32.51,29.66 24.07,29.66 19.7,25.28 v19.05,25.28 | v41.55,43.97 41.55,44.99 41,45.54 41,47.08 v40.64,47.44
VBUS  (via drill 0.35)  (1 unrouted)
  Top 0.152: IC1.2 IC1.1 13.51,51.51 | IC2.1 IC2.2 37.16,42.16 v34.54,42.16 | 13.51,51.51 13.63,51.63 C5.1 23.05,51.82 v25.4,51.82 27.69,51.82 27.94,51.56 C4.1 30.16,53.85 38.61,53.85 44.68,59.92 MC_1.4 | MC_0.4 7.6,57.42 13.51,51.51 | ABS_1.1 37.28,6.3 35.7,7.88 35.7,10.05 35.83,10.19 37.87,10.19 40.01,12.32 U6.1 40.01,16.13 39.88,16.26 36.58,16.26 36.58,21.08 | ABS_0.1 4.77,6.04 10.13,11.4 14.59,11.4 14.61,11.42 U5.1 | U3.8 37.9,26.92 36.58,26.92 | 36.58,26.92 36.58,21.08 | 36.58,26.92 36.62,26.96 36.58,27.01 36.58,30.23 | v36.58,34.54 36.58,30.23 | 36.58,30.23 34.06,30.23 U4.8 | U2.8 36.62,21.04 36.58,21.08
  Bottom 0.152: POWER.1 24.77,51.82 | 24.77,51.82 24.77,41.77 25.15,41.4 34.54,41.4 | 34.54,41.4 38.1,41.4 38.35,41.15 38.35,38.35 | 38.35,38.35 38.42,38.29 C1.1 | U1.3 41.53,38.41 C1.1 | C1.1 44.38,35.56 VBUS.1 | 34.54,41.4 v34.54,42.16 | 24.77,51.82 v25.4,51.82 | v36.58,34.54 38.35,36.32 38.35,38.35
VEXC_0  (via drill 0.35)
  Top 0.152: LC_0.1 10.82,46.83 11.81,45.85 IC1.4 17.27,45.85 v17.27,47.24 17.27,47.12 IC1.14 | v16.91,52.32 16.31,52.93 16.31,56.67 16.33,56.7 16.33,61.14 R8.1
  Bottom 0.152: v17.27,47.24 16.33,47.24 16.33,51.74 v16.91,52.32
VEXC_1  (via drill 0.35)
  Top 0.152: LC_1.1 44.55,43.08 43.05,44.58 IC2.4 34.67,44.58 v34.54,44.7 34.54,43.34 34.51,43.31 IC2.14
  Bottom 0.152: v34.54,44.7 31.5,47.75 31.5,60.96 32.77,62.23 R6.1
VNEG_0
  Top 0.152: IC1.7 12.57,42.04 10.28,44.33 LC_0.3
VNEG_1
  Top 0.152: IC2.7 37.95,47.73 38.43,47.73 38.93,47.23 38.93,45.57 39.32,45.19 43.31,45.19 43.53,44.96 45.47,44.96 LC_1.3
VOUT_0  (via drill 0.35)  (1 unrouted)
  Top 0.152: IC1.11 IC1.10 17.65,42.04 v17.53,41.91 | R10.1 10.92,32.58
  Bottom 0.152: v10.92,34.04 12.74,35.85 13.21,35.85 17.53,40.17 v17.53,41.91
VOUT_1  (via drill 0.35)
  Top 0.152: IC2.10 IC2.11 30.23,47.12 30.23,40.89 29.97,40.64 v29.72,40.64 | R12.2 9.97,19.56 v9.4,19.56
  Bottom 0.152: v9.4,19.56 8.64,20.32 8.64,30.73 19,41.1 29.72,41.1 v29.72,40.64
VPLUS_0
  Top 0.152: IC1.6 11.81,43.31 9.54,45.58 LC_0.2
VPLUS_1
  Top 0.152: LC_1.2 43.94,44.33 43.73,44.33 43.18,44.88 39.19,44.88 38.63,45.45 38.63,47.1 38.61,47.12 IC2.6
(copper drawn outside any net)
  shapes: Top area x2

### Text on the board
tNames: PE3 | PA6 | PA7